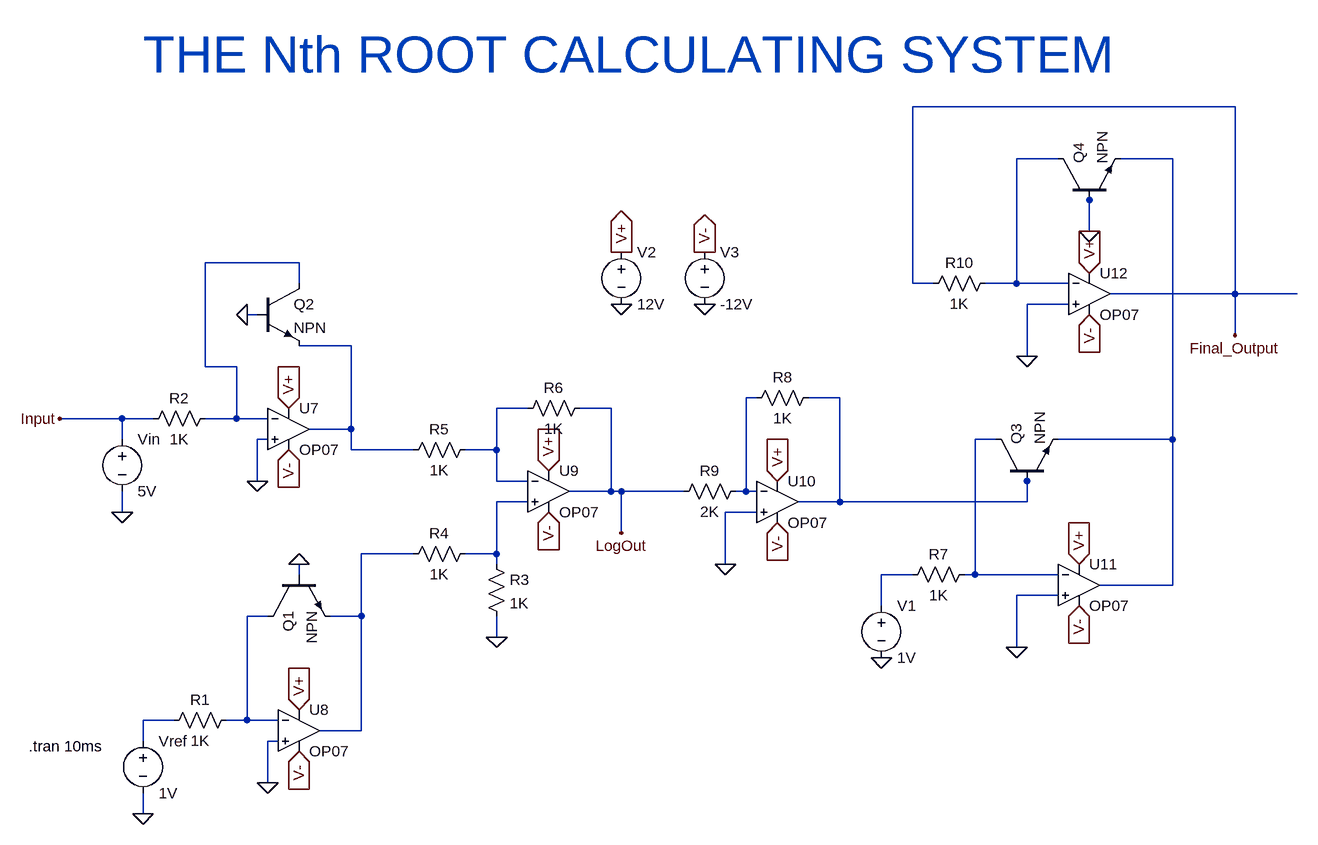
[diagram p0: schematic Nth_Root.asc]
Nth_Root.asc, the LTspice schematic file:
Version 4
SHEET 1 1668 680
WIRE 1568 -704 1072 -704
WIRE 1296 -624 1232 -624
WIRE 1472 -624 1392 -624
WIRE 1344 -560 1344 -576
WIRE 1344 -512 1344 -560
WIRE 128 -464 -16 -464
WIRE 128 -432 128 -464
WIRE 1072 -432 1072 -704
WIRE 1104 -432 1072 -432
WIRE 1232 -432 1232 -624
WIRE 1232 -432 1184 -432
WIRE 1312 -432 1232 -432
WIRE 1568 -416 1568 -704
WIRE 1568 -416 1376 -416
WIRE 1664 -416 1568 -416
WIRE 1312 -400 1248 -400
WIRE 64 -384 48 -384
WIRE 1568 -352 1568 -416
WIRE 208 -336 128 -336
WIRE 1248 -320 1248 -400
WIRE -16 -304 -16 -464
WIRE 32 -304 -16 -304
WIRE 832 -256 816 -256
WIRE 960 -256 912 -256
WIRE 480 -240 432 -240
WIRE 608 -240 560 -240
WIRE -144 -224 -240 -224
WIRE -96 -224 -144 -224
WIRE 32 -224 32 -304
WIRE 32 -224 -16 -224
WIRE 80 -224 32 -224
WIRE 208 -208 208 -336
WIRE 208 -208 144 -208
WIRE -144 -192 -144 -224
WIRE 80 -192 64 -192
WIRE 1200 -192 1168 -192
WIRE 1472 -192 1472 -624
WIRE 1472 -192 1296 -192
WIRE 208 -176 208 -208
WIRE 304 -176 208 -176
WIRE 432 -176 432 -240
WIRE 432 -176 384 -176
WIRE 64 -128 64 -192
WIRE 432 -128 432 -176
WIRE 480 -128 432 -128
WIRE 1248 -128 1248 -144
WIRE 608 -112 608 -240
WIRE 608 -112 544 -112
WIRE 624 -112 608 -112
WIRE 720 -112 624 -112
WIRE 816 -112 816 -256
WIRE 816 -112 800 -112
WIRE 832 -112 816 -112
WIRE 480 -96 432 -96
WIRE 960 -96 960 -256
WIRE 960 -96 896 -96
WIRE 1248 -96 1248 -128
WIRE 1248 -96 960 -96
WIRE -144 -80 -144 -112
WIRE 832 -80 784 -80
WIRE 624 -48 624 -112
WIRE 304 -16 224 -16
WIRE 432 -16 432 -96
WIRE 432 -16 384 -16
WIRE 432 0 432 -16
WIRE 784 0 784 -80
WIRE 128 16 128 0
WIRE 1072 16 1024 16
WIRE 1168 16 1168 -192
WIRE 1168 16 1152 16
WIRE 1296 16 1168 16
WIRE 1472 32 1472 -192
WIRE 1472 32 1360 32
WIRE 1296 48 1232 48
WIRE 1024 64 1024 16
WIRE 80 80 48 80
WIRE 224 80 224 -16
WIRE 224 80 176 80
WIRE 432 112 432 80
WIRE 1232 128 1232 48
WIRE -64 240 -112 240
WIRE 48 240 48 80
WIRE 48 240 16 240
WIRE 96 240 48 240
WIRE 224 256 224 80
WIRE 224 256 160 256
WIRE -112 272 -112 240
WIRE 96 272 80 272
WIRE 80 336 80 272
WIRE -112 384 -112 352
FLAG -112 384 0
FLAG 80 336 0
FLAG 128 0 0
FLAG -144 -80 0
FLAG 64 -128 0
FLAG 48 -384 0
FLAG 432 112 0
FLAG -240 -224 Input
FLAG 624 -48 LogOut
FLAG 784 0 0
FLAG 1024 144 0
FLAG 1232 128 0
FLAG 1248 -320 0
FLAG 1344 -512 0
FLAG 1568 -352 Final_Output
FLAG 624 -400 0
FLAG 752 -400 0
FLAG 624 -480 V+
IOPIN 624 -480 Out
FLAG 752 -480 V-
IOPIN 752 -480 Out
FLAG 112 -240 V+
IOPIN 112 -240 In
FLAG 112 -176 V-
IOPIN 112 -176 In
FLAG 128 224 V+
IOPIN 128 224 In
FLAG 128 288 V-
IOPIN 128 288 In
FLAG 512 -144 V+
IOPIN 512 -144 In
FLAG 512 -80 V-
IOPIN 512 -80 In
FLAG 864 -128 V+
IOPIN 864 -128 In
FLAG 864 -64 V-
IOPIN 864 -64 In
FLAG 1328 64 V-
IOPIN 1328 64 In
FLAG 1344 -448 V+
IOPIN 1344 -448 In
FLAG 1344 -384 V-
IOPIN 1344 -384 In
FLAG 1328 0 V+
IOPIN 1328 0 In
SYMBOL res 32 224 R90
WINDOW 0 0 56 VBottom 2
WINDOW 3 32 56 VTop 2
SYMATTR InstName R1
SYMATTR Value 1K
SYMBOL voltage -112 256 R0
WINDOW 123 0 0 Left 2
WINDOW 39 0 0 Left 2
SYMATTR InstName Vref
SYMATTR Value 1V
SYMBOL npn 80 16 M90
SYMATTR InstName Q1
SYMBOL res 0 -240 R90
WINDOW 0 0 56 VBottom 2
WINDOW 3 32 56 VTop 2
SYMATTR InstName R2
SYMATTR Value 1K
SYMBOL voltage -144 -208 R0
WINDOW 123 0 0 Left 2
WINDOW 39 0 0 Left 2
SYMATTR InstName Vin
SYMATTR Value 5V
SYMBOL npn 64 -432 R0
SYMATTR InstName Q2
SYMBOL res 416 -16 R0
SYMATTR InstName R3
SYMATTR Value 1K
SYMBOL res 400 -32 R90
WINDOW 0 0 56 VBottom 2
WINDOW 3 32 56 VTop 2
SYMATTR InstName R4
SYMATTR Value 1K
SYMBOL res 400 -192 R90
WINDOW 0 0 56 VBottom 2
WINDOW 3 32 56 VTop 2
SYMATTR InstName R5
SYMATTR Value 1K
SYMBOL res 576 -256 R90
WINDOW 0 0 56 VBottom 2
WINDOW 3 32 56 VTop 2
SYMATTR InstName R6
SYMATTR Value 1K
SYMBOL res 928 -272 R90
WINDOW 0 0 56 VBottom 2
WINDOW 3 32 56 VTop 2
SYMATTR InstName R8
SYMATTR Value 1K
SYMBOL res 816 -128 R90
WINDOW 0 0 56 VBottom 2
WINDOW 3 32 56 VTop 2
SYMATTR InstName R9
SYMATTR Value 2K
SYMBOL voltage 1024 48 R0
WINDOW 123 0 0 Left 2
WINDOW 39 0 0 Left 2
SYMATTR InstName V1
SYMATTR Value 1V
SYMBOL res 1168 0 R90
WINDOW 0 0 56 VBottom 2
WINDOW 3 32 56 VTop 2
SYMATTR InstName R7
SYMATTR Value 1K
SYMBOL npn 1200 -128 R270
SYMATTR InstName Q3
SYMBOL npn 1296 -560 R270
SYMATTR InstName Q4
SYMBOL res 1200 -448 R90
WINDOW 0 0 56 VBottom 2
WINDOW 3 32 56 VTop 2
SYMATTR InstName R10
SYMATTR Value 1K
SYMBOL voltage 624 -496 R0
WINDOW 123 0 0 Left 2
WINDOW 39 0 0 Left 2
SYMATTR InstName V2
SYMATTR Value 12V
SYMBOL voltage 752 -496 R0
WINDOW 123 0 0 Left 2
WINDOW 39 0 0 Left 2
SYMATTR InstName V3
SYMATTR Value -12V
SYMBOL Opamps\\OP07 112 -272 R0
SYMATTR InstName U7
SYMBOL Opamps\\OP07 128 192 R0
SYMATTR InstName U8
SYMBOL Opamps\\OP07 512 -176 R0
SYMATTR InstName U9
SYMBOL Opamps\\OP07 864 -160 R0
SYMATTR InstName U10
SYMBOL Opamps\\OP07 1328 -32 R0
SYMATTR InstName U11
SYMBOL Opamps\\OP07 1344 -480 R0
SYMATTR InstName U12
TEXT -288 280 Left 2 !.tran 10ms
TEXT -112 -784 Left 6 ;THE Nth ROOT CALCULATING SYSTEM

The netlist it stands for:
* Nth_Root.asc
R1 N012 N013 1K
Vref N013 0 1V
Q1 N012 0 N010 0 NPN
R2 N003 Input 1K
Vin Input 0 5V
Q2 N003 0 N004 0 NPN
R3 N009 0 1K
R4 N009 N010 1K
R5 N007 N004 1K
R6 LogOut N007 1K
R8 N006 N005 1K
R9 N005 LogOut 2K
V1 N011 0 1V
R7 N008 N011 1K
Q3 N008 N006 N002 0 NPN
Q4 N001 0 N002 0 NPN
R10 N001 Final_Output 1K
V2 V+ 0 12V
V3 V- 0 -12V
XU7 0 N003 V+ V- N004 LT1001  ; OP07, pins In+ In- V+ V- OUT
XU8 0 N012 V+ V- N010 LT1001  ; OP07, pins In+ In- V+ V- OUT
XU9 N009 N007 V+ V- LogOut LT1001  ; OP07, pins In+ In- V+ V- OUT
XU10 0 N005 V+ V- N006 LT1001  ; OP07, pins In+ In- V+ V- OUT
XU11 0 N008 V+ V- N002 LT1001  ; OP07, pins In+ In- V+ V- OUT
XU12 0 N001 V+ V- Final_Output LT1001  ; OP07, pins In+ In- V+ V- OUT
.model NPN NPN
.model PNP PNP
.lib standard.bjt
.tran 10ms
* THE Nth ROOT CALCULATING SYSTEM
.lib LTC.lib
.backanno
.end